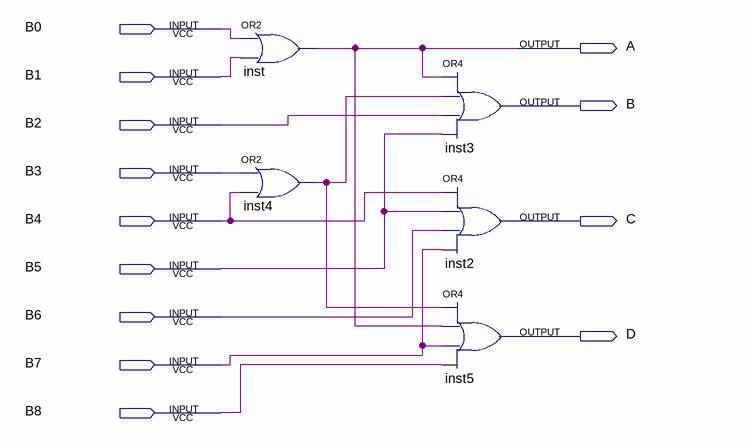
[diagram p0: schematic sheet]
// Quartus schematic decod4.bdf as structural Verilog: 5 symbols, 13 pins
module decod4 (
  input  B0,
  input  B1,
  input  B2,
  input  B3,
  input  B4,
  input  B5,
  input  B6,
  input  B7,
  input  B8,
  output A,
  output B,
  output C,
  output D
);

  wire inst4_out;

  or inst (A, B0, B1);
  or inst4 (inst4_out, B3, B4);
  or inst3 (B, A, inst4_out, B2, B5);
  or inst2 (C, B4, B5, B6, B7);
  or inst5 (D, inst4_out, A, B7, B8);
endmodule
